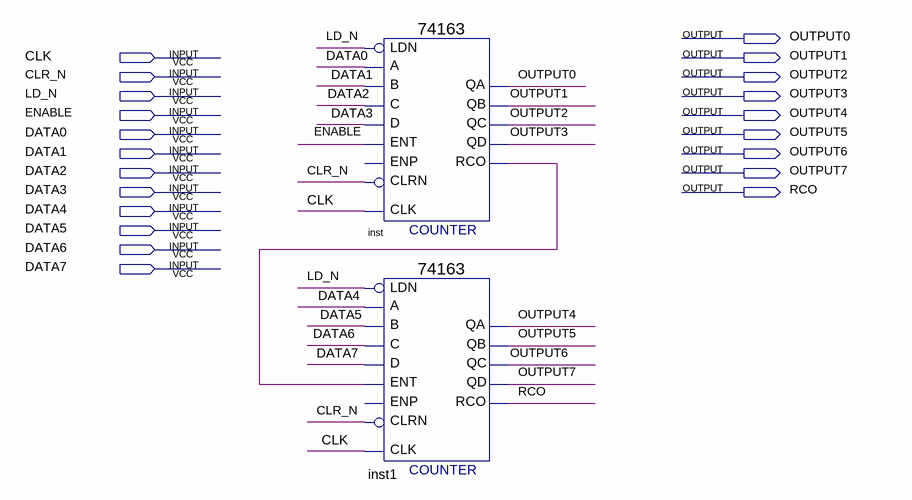
[diagram p0: schematic sheet]
// Quartus schematic counter.bdf as structural Verilog: 2 symbols, 21 pins
module counter (
  input  CLK,
  input  CLR_N,
  input  LD_N,
  input  ENABLE,
  input  DATA0,
  input  DATA1,
  input  DATA2,
  input  DATA3,
  input  DATA4,
  input  DATA5,
  input  DATA6,
  input  DATA7,
  output OUTPUT0,
  output OUTPUT1,
  output OUTPUT2,
  output OUTPUT3,
  output OUTPUT4,
  output OUTPUT5,
  output OUTPUT6,
  output OUTPUT7,
  output RCO
);

  wire inst_rco;

  \74163  inst (
    .C(DATA2), .B(DATA1), .A(DATA0), .ENT(ENABLE), .D(DATA3), .CLRN(CLR_N), .CLK(CLK), .LDN(LD_N),
    .QA(OUTPUT0), .QB(OUTPUT1), .QC(OUTPUT2), .QD(OUTPUT3), .RCO(inst_rco));  // open: ENP
  \74163  inst1 (
    .C(DATA6), .B(DATA5), .A(DATA4), .ENT(inst_rco), .D(DATA7), .CLRN(CLR_N), .CLK(CLK), .LDN(LD_N),
    .QA(OUTPUT4), .QB(OUTPUT5), .QC(OUTPUT6), .QD(OUTPUT7), .RCO(RCO));  // open: ENP
endmodule
